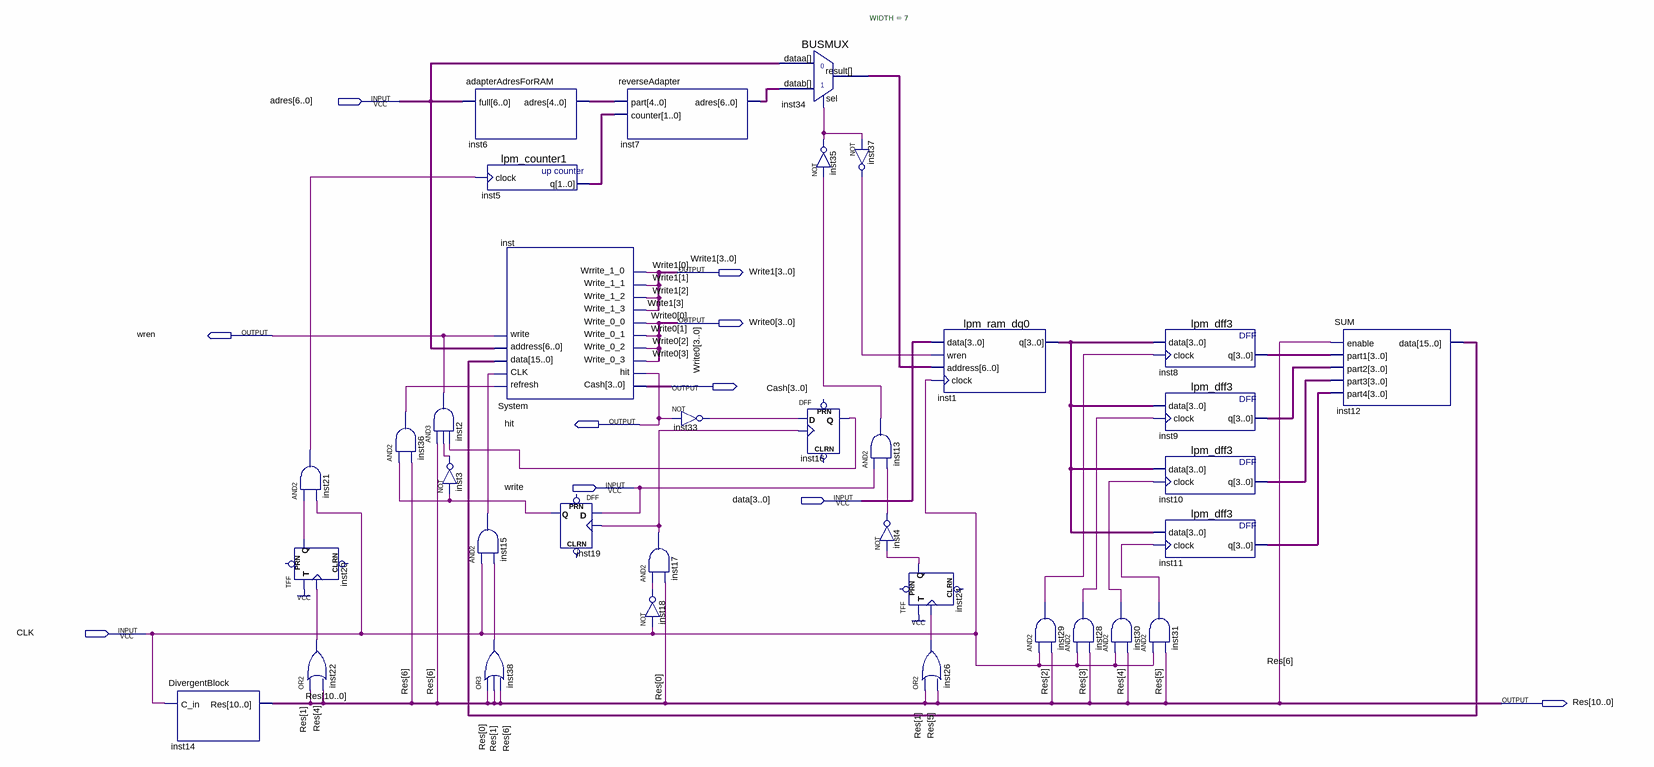
[diagram p0: schematic sheet]
// Quartus schematic L6.bdf as structural Verilog: 35 symbols, 10 pins
module L6 (
  input  [6:0] adres,
  input  write,
  input  [3:0] data,
  input  CLK,
  output [3:0] Write1,
  output [3:0] Write0,
  output wren,
  output [3:0] Cash,
  output hit,
  output [10:0] Res
);

  wire inst3_out, inst4_out, inst13_out, inst15_out, inst16_q, inst17_out, inst18_out, inst19_q, inst20_q,
       inst21_out, inst22_out, inst24_q, inst26_out, inst28_out, inst29_out, inst30_out, inst31_out,
       inst33_out, inst35_out, inst36_out, inst37_out, inst38_out;
  wire [1:0] inst5_q;
  wire [3:0] inst1_q, inst8_q, inst9_q, inst10_q, inst11_q;
  wire [4:0] inst6_adres;
  wire [6:0] inst7_adres, inst34_result;
  wire [15:0] inst12_data;

  DivergentBlock inst14 (.C_in(CLK), .Res(Res));
  and inst21 (inst21_out, inst20_q, CLK);
  TFF inst20 (.T(1'b1), .CLK(inst22_out), .Q(inst20_q));  // open: PRN, CLRN
  or inst22 (inst22_out, Res[1], Res[4]);
  and inst36 (inst36_out, inst19_q, Res[6]);
  adapterAdresForRAM inst6 (.full(adres), .adres(inst6_adres));
  and inst2 (wren, Res[6], inst3_out, inst16_q);
  not inst3 (inst3_out, inst19_q);
  lpm_counter1 inst5 (.clock(inst21_out), .q(inst5_q));
  System inst (
    .refresh(inst36_out), .CLK(inst15_out), .data(inst12_data), .address(adres), .write(wren), .Cash(Cash),
    .hit(hit), .Write_0_3(Write0[3]), .Write_0_2(Write0[2]), .Write_0_1(Write0[1]), .Write_0_0(Write0[0]),
    .Write_1_3(Write1[3]), .Write_1_2(Write1[2]), .Write_1_1(Write1[1]), .Wrrite_1_0(Write1[0]));
  and inst15 (inst15_out, CLK, inst38_out);
  or inst38 (inst38_out, Res[0], Res[1], Res[6]);
  DFF inst19 (.CLK(inst17_out), .D(write), .Q(inst19_q));  // open: CLRN, PRN
  reverseAdapter inst7 (.part(inst6_adres), .counter(inst5_q), .adres(inst7_adres));
  and inst17 (inst17_out, inst18_out, Res[0]);
  not inst18 (inst18_out, CLK);
  not inst33 (inst33_out, hit);
  BUSMUX #(.WIDTH(7)) inst34 (.datab(inst7_adres), .sel(inst35_out), .dataa(adres), .result(inst34_result));
  not inst35 (inst35_out, inst13_out);
  DFF inst16 (.CLK(inst17_out), .D(inst33_out), .Q(inst16_q));  // open: CLRN, PRN
  not inst37 (inst37_out, inst35_out);
  and inst13 (inst13_out, write, inst4_out);
  not inst4 (inst4_out, inst24_q);
  TFF inst24 (.T(1'b1), .CLK(inst26_out), .Q(inst24_q));  // open: PRN, CLRN
  or inst26 (inst26_out, Res[1], Res[5]);
  lpm_ram_dq0 inst1 (.data(data), .wren(inst37_out), .address(inst34_result), .clock(CLK), .q(inst1_q));
  and inst28 (inst28_out, CLK, Res[3]);
  and inst29 (inst29_out, CLK, Res[2]);
  and inst30 (inst30_out, CLK, Res[4]);
  lpm_dff3 inst8 (.data(inst1_q), .clock(inst29_out), .q(inst8_q));
  lpm_dff3 inst9 (.data(inst1_q), .clock(inst28_out), .q(inst9_q));
  lpm_dff3 inst10 (.data(inst1_q), .clock(inst30_out), .q(inst10_q));
  lpm_dff3 inst11 (.data(inst1_q), .clock(inst31_out), .q(inst11_q));
  and inst31 (inst31_out, CLK, Res[5]);
  SUM inst12 (
    .enable(Res[6]), .part1(inst8_q), .part2(inst9_q), .part3(inst10_q), .part4(inst11_q), .data(inst12_data));
endmodule
